# Altium project KEYPAD.PrjPcb
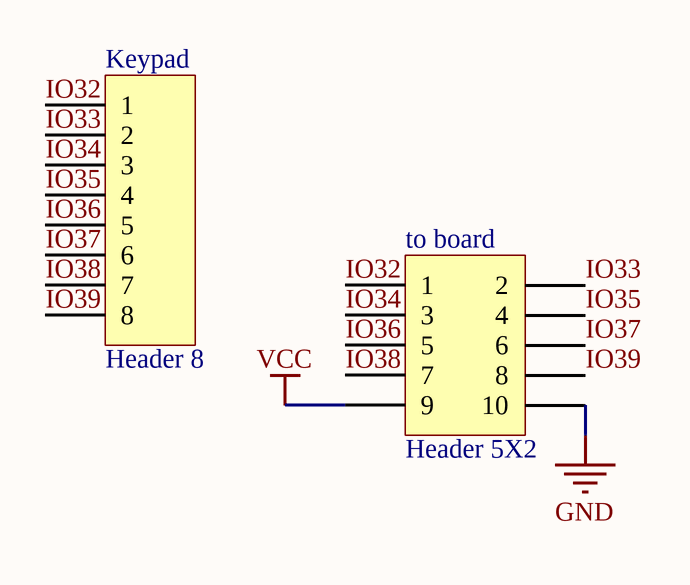
[diagram p0: KEYPAD.SchDoc]
1 sheet, 2 parts. Net scope: global (net labels, ports and power ports of the same name join across sheets).
Board file: KEYPAD.PcbDoc

## Sheet KEYPAD.SchDoc
size A

### Parts
Keypad  Header 8  [HDR1X8]
to_board  Header 5X2  [HDR2X5]

### Nets
GND: to_board.10
VCC: to_board.9
IO32: Keypad.1 to_board.1
IO33: Keypad.2 to_board.2
IO34: Keypad.3 to_board.3
IO35: Keypad.4 to_board.4
IO36: Keypad.5 to_board.5
IO37: Keypad.6 to_board.6
IO38: Keypad.7 to_board.7
IO39: Keypad.8 to_board.8

### Library data of the parts
Keypad = Header 8: Header, 8-Pin; LatestRevisionDate: 17-Jul-2002; LatestRevisionNote: Re-released for DXP Platform.; Publisher: Altium Limited
to_board = Header 5X2: Header, 5-Pin, Dual row; LatestRevisionDate: 17-Jul-2002; LatestRevisionNote: Re-released for DXP Platform.; Publisher: Altium Limited